# EAGLE design CONTROLADOR_MAX31865_RELE (EAGLE 7.7.0)
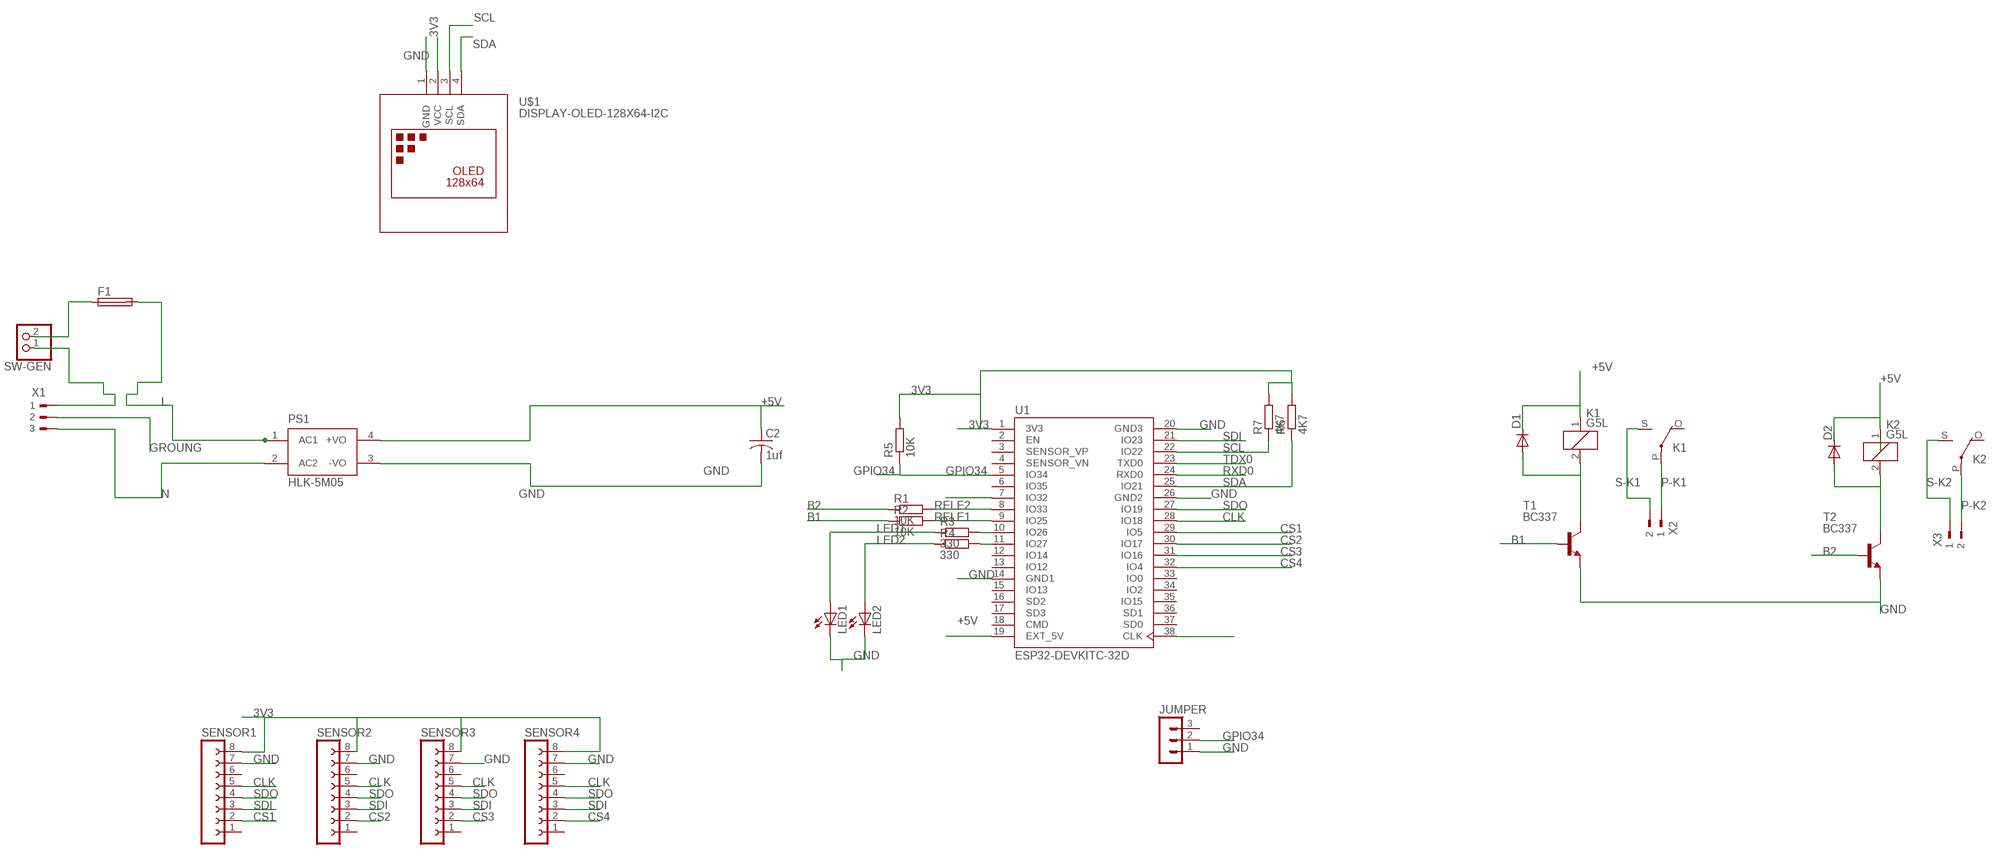
[diagram p0: schematic, sheet 1]

## Parts
C2  1uf  C-USC1206  [C1206]
D1  DIODE-DO214AC  [DO214AC]
D2  DIODE-DO214AC  [DO214AC]
F1  SH22,5A  [SH22,5A]
JUMPER  MA03-1  [MA03-1]
K1  G5L  [G5LE]
K2  G5L  [G5LE]
LED1  LED3MM  [LED3MM]
LED2  LED3MM  [LED3MM]
PS1  HLK-5M05  [CONV_HLK-5M05]
R1  10K  R-EU_M1206  [M1206]
R2  10K  R-EU_M1206  [M1206]
R3  330  R-EU_M1206  [M1206]
R4  330  R-EU_M1206  [M1206]
R5  10K  R-EU_M1206  [M1206]
R6  4K7  R-EU_M1206  [M1206]
R7  4K7  R-EU_M1206  [M1206]
SENSOR1  FE08-1  [FE08]
SENSOR2  FE08-1  [FE08]
SENSOR3  FE08-1  [FE08]
SENSOR4  FE08-1  [FE08]
SW-GEN  PINHD-1X2  [1X02]
T1  BC337  [TO92]
T2  BC337  [TO92]
U1  ESP32-DEVKITC-32D  [MODULE_ESP32-DEVKITC-32D]
U$1  DISPLAY-OLED-128X64-I2C  [DISPLAY-OLED-128X64-I2C]
X1  180G-3  [180G-3]
X2  90-2  [90-2]
X3  90-2  [90-2]

## Nets
3V3: R5.2 R6.2 R7.2 SENSOR1.8 SENSOR2.8 SENSOR3.8 SENSOR4.8 U1.1(3V3) U$1.2(VCC)
+5V: C2.1 D1.C D2.C K1.1 K2.1 PS1.4(+VO) U1.19(EXT_5V)
B1: R2.1 T1.2(B)
B2: R1.1 T2.2(B)
CCLK: U1.38(CLK)
CLK: SENSOR1.5 SENSOR2.5 SENSOR3.5 SENSOR4.5 U1.28(IO18)
CS1: SENSOR1.2 U1.29(IO5)
CS2: SENSOR2.2 U1.30(IO17)
CS3: SENSOR3.2 U1.31(IO16)
CS4: SENSOR4.2 U1.32(IO4)
GND: C2.2 JUMPER.1 LED1.K(C) LED2.K(C) PS1.3(-VO) SENSOR1.7 SENSOR2.7 SENSOR3.7 SENSOR4.7 T1.1(E) T2.1(E) U1.14(GND1) U1.20(GND3) U1.26(GND2) U$1.1(GND)
GPIO34: JUMPER.2 R5.1 U1.5(IO34)
GROUNG: X1.2
L: F1.2 PS1.1(AC1)
L.: SW-GEN.1 X1.1
LED1: LED1.A R3.1
LED2: LED2.A R4.1
N: PS1.2(AC2) X1.3
N$17: F1.1 SW-GEN.2
N$18: U1.7(IO32)
N$22: R3.2 U1.10(IO26)
N$23: R4.2 U1.11(IO27)
N$24: D1.A K1.2 T1.3(C)
N$26: D2.A K2.2 T2.3(C)
P-K1: K1.P(2:P) X2.1
P-K2: K2.P(2:P) X3.2
RELE1: R2.2 U1.9(IO25)
RELE2: R1.2 U1.8(IO33)
RXD0: U1.24(RXD0)
S-K1: K1.S(2:S) X2.2
S-K2: K2.S(2:S) X3.1
SCL: R7.1 U1.22(IO22) U$1.3(SCL)
SDA: R6.1 U1.25(IO21) U$1.4(SDA)
SDI: SENSOR1.3 SENSOR2.3 SENSOR3.3 SENSOR4.3 U1.21(IO23)
SDO: SENSOR1.4 SENSOR2.4 SENSOR3.4 SENSOR4.4 U1.27(IO19)
TDX0: U1.23(TXD0)
Unconnected: JUMPER.3 K1.O(2:O) K2.O(2:O) SENSOR1.1 SENSOR1.6 SENSOR2.1 SENSOR2.6 SENSOR3.1 SENSOR3.6 SENSOR4.1 SENSOR4.6 U1.2(EN) U1.3(SENSOR_VP) U1.4(SENSOR_VN) U1.6(IO35) U1.12(IO14) U1.13(IO12) U1.15(IO13) U1.16(SD2) U1.17(SD3) U1.18(CMD) U1.33(IO0) U1.34(IO2) U1.35(IO15) U1.36(SD1) U1.37(SD0)

## Library data of the parts
C2 = adafruit:C-US: CAPACITOR, American symbol
D1 D2 = diode:DIODE-: DIODE
F1 = fuse:SH22,5A: FUSE HOLDER grid 22,5mm, isolated cap OGN0031 8201, Schurter (Buerklin); MPN: 0031.7701.11; OC_FARNELL: unknown; OC_NEWARK: 04F1224
JUMPER = con-lstb:MA03-1: PIN HEADER; OC_FARNELL: unknown; OC_NEWARK: unknown
K1 K2 = relay:G5L: RELAY 1 x switch, 10 A/120 V AC, 8 A/30 V ADC, Omron; OC_FARNELL: unknown; OC_NEWARK: unknown
LED1 LED2 = adafruit:LED: LED OSRAM: - CHIPLED LG R971, LG N971, LY N971, LG Q971, LY Q971, LO R971, LY R971 LH N974, LH R974 LS Q976, LO Q976, LY Q976 LO Q996 - Hyper CHIPLED LW Q18S LB Q993, LB Q99A, LB R99A - SideLED LS A670, LO A670, LY A670, LG A670, LP A670 LB A673, LV A673, LT A673, LW A673 LH A674 LY A675 LS A676, LA A676, LO A676, LY A676, LW A676 LS A679, LY A679, LG A679 - Hyper Micro SIDELED® LS Y876, LA Y876, LO Y876, LY Y876 LT Y87S - SmartLED LW L88C, LW L88S LB L89C, LB L89S, LG L890 LS L89K, LO L89K, LY L89K LS L896, LA L896, LO L896, LY L896 - TOPLED LS T670, LO T670, LY T670, LG T670, LP T670 LSG T670, LSP T670, LSY T670, LOP T670, LYG T670 LG T671, LOG T671, LSG T671 LB T673, LV T673, LT T673, LW T673 LH T674 LS T676, LA T676, LO T676, LY T676, LB T676, LH T676, LSB T676, LW T676 LB T67C, LV T67C, LT T67C, LS T67K, LO T67K, LY T67K, LW E67C LS E67B, LA E67B, LO E67B, LY E67B, LB E67C, LV E67C, LT E67C LW T67C LS T679, LY T679, LG T679 LS T770, LO T770, LY T770, LG T770, LP T770 LB T773, LV T773, LT T773, LW T773 LH T774 LS E675, LA E675, LY E675, LS T675 LS T776, LA T776, LO T776, LY T776, LB T776 LHGB T686 LT T68C, LB T68C - Hyper Mini TOPLED® LB M676 - Mini TOPLED Santana® LG M470 LS M47K, LO M47K, LY M47K Source: http://www.osram.convergy.de/
PS1 = HLK-5M05:HLK-5M05: AC DC 220V to 5V 5W 5Watt Isolated Switching Step-Down Power Supply Module Converter Check availability <https://pricing.snapeda.com/parts/HLK-5M05/Hi-link/view-part?ref=eda>; AVAILABILITY: Not in stock; MF: Hi-link; MP: HLK-5M05; PACKAGE: Package; PRICE: None
R1-R7 = resistor:R-EU_: RESISTOR, European symbol
SENSOR1-SENSOR4 = con-lsta:FE08-1: FEMALE HEADER; OC_FARNELL: unknown; OC_NEWARK: unknown
SW-GEN = pinhead:PINHD-1X2: PIN HEADER
T1 T2 = transistor:BC337: NPN TRANSISTOR
U1 = ESP32-DEVKITC-32D:ESP32-DEVKITC-32D: Eval Board For Esp-Wroom-32 Check prices <https://pricing.snapeda.com/parts/ESP32-DEVKITC-32D/Espressif%20Systems/view-part?ref=eda>; AVAILABILITY: In Stock; DESCRIPTION: WiFi Development Tools (802.11) ESP32 General Development Kit, ESP32-WROOM-32D on the board; MF: Espressif Systems; MP: ESP32-DEVKITC-32D; PACKAGE: None; PRICE: None; PURCHASE-URL: https://pricing.snapeda.com/search/part/ESP32-DEVKITC-32D/?ref=eda
U$1 = cargador microusb-modules lib:DISPLAY-OLED-128X64-I2C: 128x64 Dot Matrix OLED Module based on SSD1306 chip Variant with I2C interface More details available here: http://www.instructables.com/id/Monochrome-096-i2c-OLED-display-with-arduino-SSD13/ SSD1306 datasheet: https://cdn-shop.adafruit.com/datasheets/SSD1306.pdf Click here to find device on ebay.com <http://www.ebay.com/sch/oled+display+128x64+iic> Note: There are two variants: I2C and SPI. Search for the proper version.
X1 = con-weidmueller-sl35:180G-3: WEIDMUELLER CLAMP CONNECTOR; OC_FARNELL: unknown; OC_NEWARK: unknown
X2 X3 = con-weidmueller-sl35:90-2: WEIDMUELLER CLAMP CONNECTOR; OC_FARNELL: unknown; OC_NEWARK: unknown

## Board
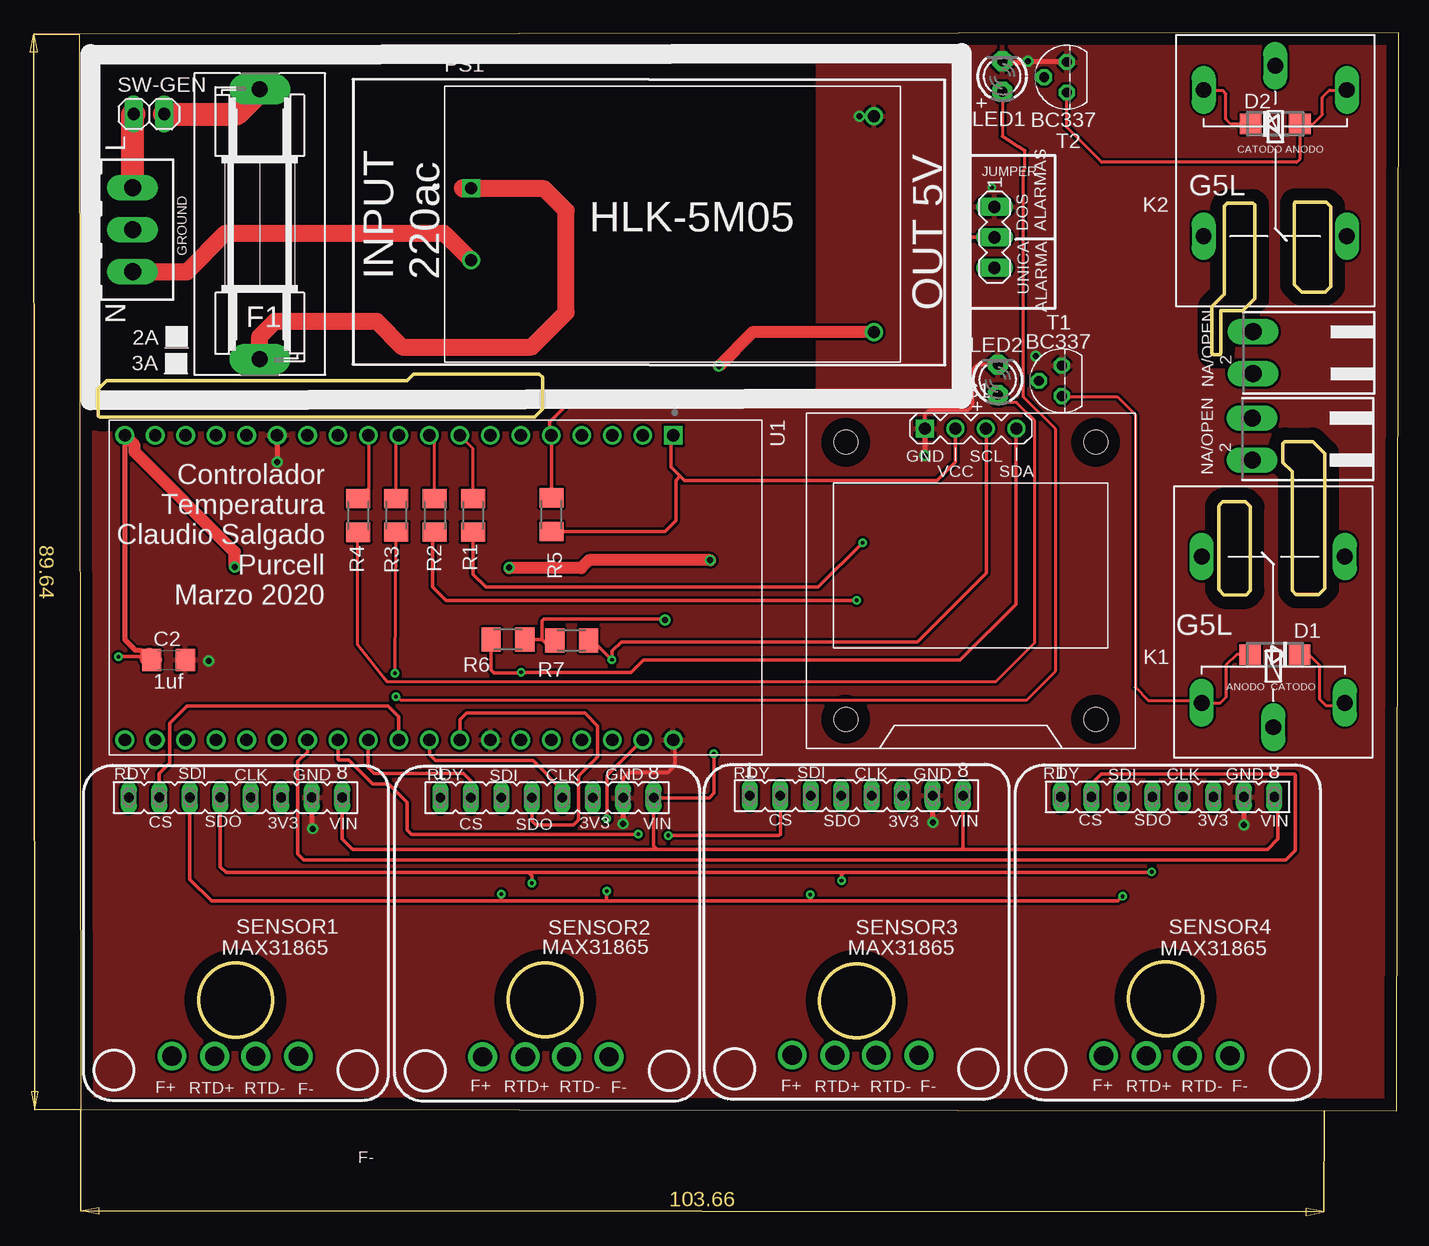
[diagram p1: board, top side]
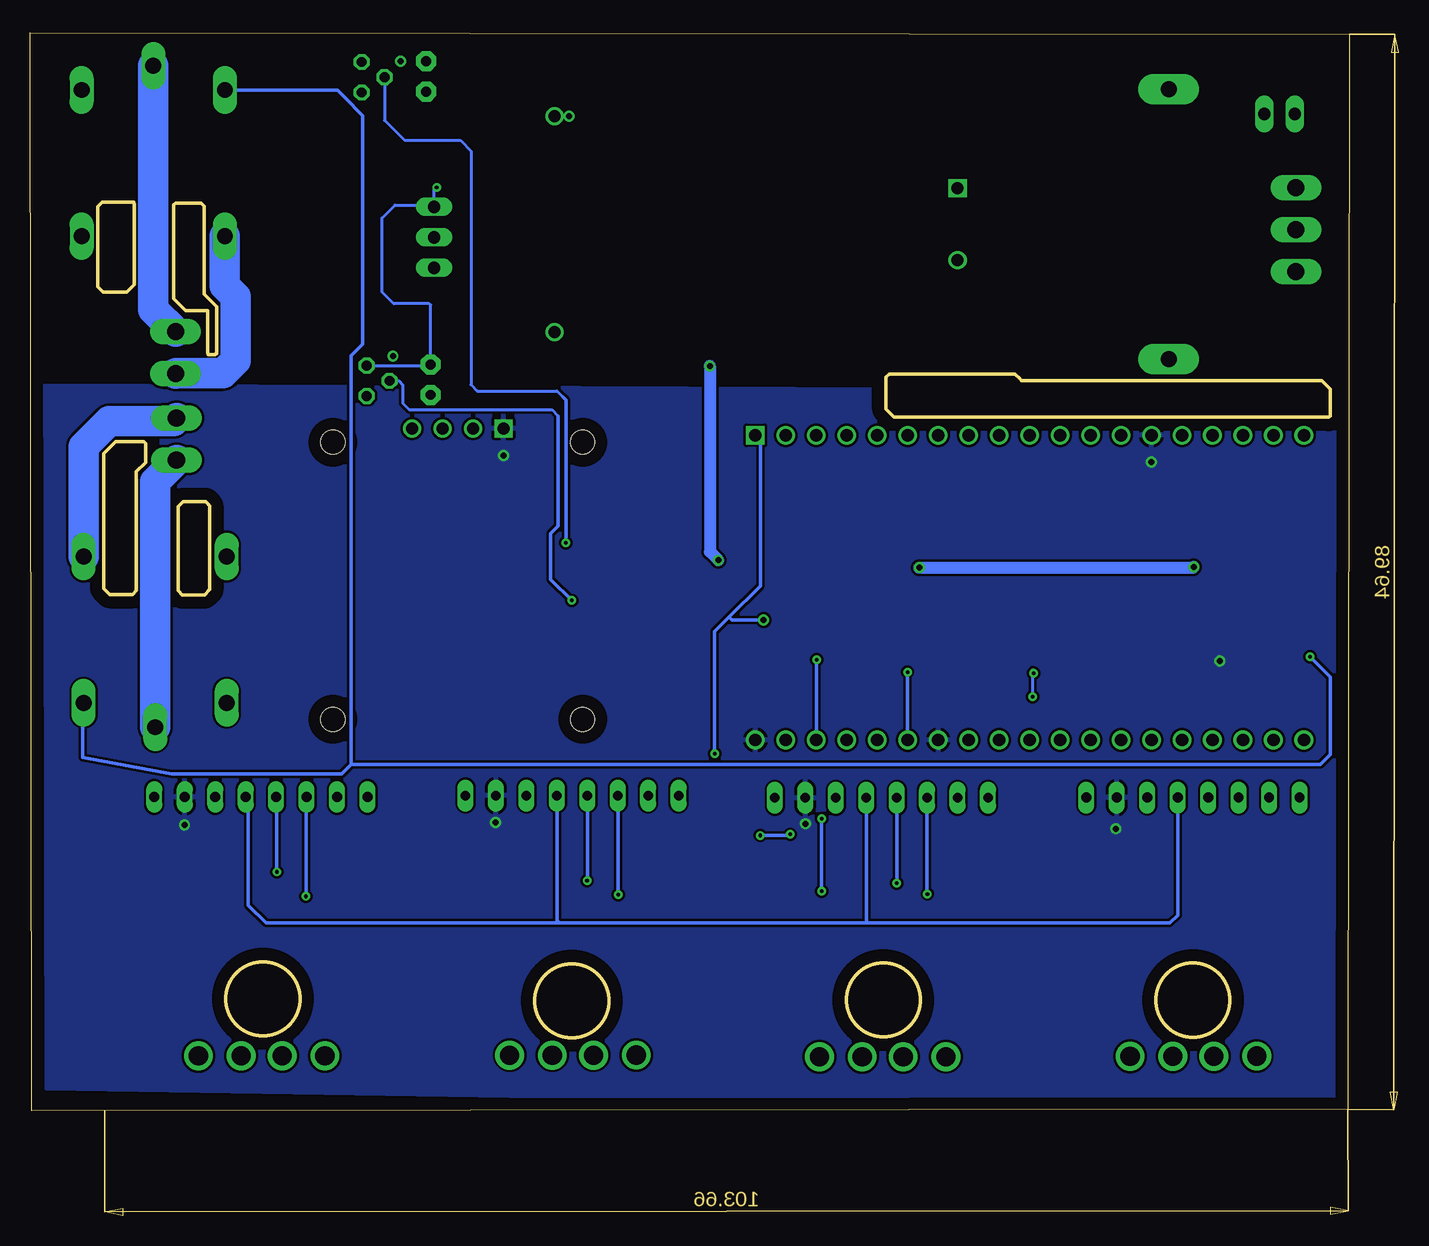
[diagram p2: board, bottom side, seen from below]

Size 109.98 x 89.86 mm. Coordinates in mm from the lower left corner, seen from the top.
Outline: 94.42,63.12 94.42,67.05 95.46,68.09 95.46,75.4 95.72,75.66
Outline: 95.76,75.69 97.84,75.69 98,75.53 98,67.7 97.01,66.71 95.16,66.7 95.16,63.27 95.12,63.05 94.54,63.05 94.44,63.15 94.45,63.15
Outline: 100.51,55.81 102.82,55.81 103.83,54.8 103.83,43.55 103.34,43.06 101.43,43.06 101.11,43.38 101.11,53.28 100.34,54.05 100.34,55.62 100.5,55.78
Outline: 101.32,75.74 103.97,75.74 104.33,75.38 104.33,68.73 103.86,68.26 101.9,68.26 101.28,68.88 101.28,75.63 101.33,75.68
Outline: 95.04,43.41 95.43,43.02 97.28,43.02 97.64,43.38 97.64,50.36 97.22,50.78 95.33,50.78 95.1,50.55 95.1,50.52 95.01,50.43 95.01,43.47 95.08,43.4
Outline: 1.72,57.84 2.24,57.84
Outline: 2.24,57.84 37.96,57.84 38.62,58.5 38.62,61.15 38.34,61.43 27.87,61.43 27.48,61.04 27.48,61.03 27.32,60.87 2.29,60.87 1.6,60.18 1.6,57.92 1.71,57.84 1.75,57.83 2.24,57.84
Outline: 0.11,0.11 109.84,0 109.98,89.86 0,89.75 0.11,0.11
Outline: circle at 13.03,9.23 radius 3.06
Outline: circle at 90.56,9.34 radius 3.06
Outline: circle at 38.84,9.24 radius 3.06
Outline: circle at 64.81,9.18 radius 3.06
Copper layers (1*16): Top 0.035mm / dielectric 1.5mm / Bottom 0.035mm
Design rules "default": minimum track width 10mil, minimum drill 24mil, track to track 8mil, track to pad 8mil, pad to pad 8mil, via to via 8mil, smd to smd 8mil, copper to edge 40mil, drill to drill 8mil, minimum pad ring 10mil, minimum via ring 8mil, stop-mask expansion 4mil, vias tented up to drill 0mil, thermal gap 10mil

### Footprints (pad centres in the part's own frame; a part is rotated, then mirrored left to right if it is on the bottom)
C1206 = smd 1.6 x 1.8: 1 -1.4,0; 2 1.4,0
DO214AC = smd 1.8 x 1.7: A 2.05,0; C -2.05,0
SH22,5A = drill 1.321 pad 2.54 long: 1 -11.252,0; 2 11.252,0
MA03-1 = drill 1.016 long: 1 -2.54,0; 2 0,0; 3 2.54,0
G5LE = drill 1.321 long: 1 -7.493,-5.969; 2 -7.493,5.969; O 4.699,5.969; P -9.525,0; S 4.699,-5.969
LED3MM = drill 0.813 pad 1.676 octagon: A -1.27,0; K 1.27,0
CONV_HLK-5M05 = drill 1 pad 1.5 square: 1 -16.8,3 | drill 1 pad 1.5: 2 -16.8,-3; 3 16.8,9; 4 16.8,-9
M1206 = smd 1.6 x 2: 1 -1.4,0; 2 1.4,0
FE08 = drill 0.813 long: 1 -8.89,0; 2 -6.35,0; 3 -3.81,0; 4 -1.27,0; 5 1.27,0; 6 3.81,0; 7 6.35,0; 8 8.89,0
1X02 = drill 1.016 long: 1 -1.27,0; 2 1.27,0
TO92 = drill 0.813 octagon: 1 1.27,0; 2 0,1.905; 3 -1.27,0
MODULE_ESP32-DEVKITC-32D = drill 1.04 square: 1 -12.7,19.76 | drill 1.04: 2 -12.7,17.22; 3 -12.7,14.68; 4 -12.7,12.14; 5 -12.7,9.6; 6 -12.7,7.06; 7 -12.7,4.52; 8 -12.7,1.98; 9 -12.7,-0.56; 10 -12.7,-3.1; 11 -12.7,-5.64; 12 -12.7,-8.18; 13 -12.7,-10.72; 14 -12.7,-13.26; 15 -12.7,-15.8; 16 -12.7,-18.34; 17 -12.7,-20.88; 18 -12.7,-23.42; 19 -12.7,-25.96; 20 12.7,19.76; 21 12.7,17.22; 22 12.7,14.68; 23 12.7,12.14; 24 12.7,9.6; 25 12.7,7.06; 26 12.7,4.52; 27 12.7,1.98; 28 12.7,-0.56; 29 12.7,-3.1; 30 12.7,-5.64; 31 12.7,-8.18; 32 12.7,-10.72; 33 12.7,-13.26; 34 12.7,-15.8; 35 12.7,-18.34; 36 12.7,-20.88; 37 12.7,-23.42; 38 12.7,-25.96
DISPLAY-OLED-128X64-I2C = drill 1 square: 1 -3.81,12.7 | drill 1: 2 -1.27,12.7; 3 1.27,12.7; 4 3.81,12.7 | hole 2: -10.414,11.557; 10.414,11.557; 10.414,-11.557; -10.414,-11.557
180G-3 = drill 1.422 long: 1 -3.5,0; 2 0,0; 3 3.5,0
90-2 = drill 1.422 long: 1 -1.75,5.25; 2 1.75,5.25

### Placement (x,y rotation side)
C2  7.45,37.59 0 top
D1  99.66,38.04 180 top
D2  99.7,82.27 0 top
F1  15.05,73.91 270 top
JUMPER  76.3,72.82 270 top
K1  99.54,41.51 90 top
K2  99.7,77.61 270 top
LED1  76.95,86.24 90 top
LED2  76.58,60.95 90 top
PS1  49.45,73.91 0 top
R1  32.82,49.65 90 top
R2  29.64,49.65 90 top
R3  26.42,49.65 90 top
R4  23.25,49.64 90 top
R5  39.37,49.7 270 top
R6  35.74,39.28 0 top
R7  41.05,39.23 180 top
SENSOR1  13.03,26.12 0 top
SENSOR2  39,26.1 0 top
SENSOR3  64.79,26.28 0 top
SENSOR4  90.73,26.17 0 top
SW-GEN  5.81,83.1 0 top
T1  81.91,60.86 90 top
T2  82.33,86.17 90 top
U1  29.75,43.62 270 top
U$1  74.32,44.19 0 top
X1  4.45,73.46 270 top
X2  103.02,56 90 top
X3  103.1,63.2 90 top

### Tracks (layer width: path | path; a pad name or v marks a point on that pad's centre or on a via)
3V3  (via drill 0.3, 0.5)
  Top 0.305: 50.09,52.91 50.46,52.54 71.49,52.54 73.05,54.1 U$1.2 | 50.09,52.91 49.32,53.68 49.32,56.13 U1.1 | 50.09,52.91 49.73,52.54 49.73,49.21 48.82,48.3 R5.2 | SENSOR1.8 21.92,22.67 22.79,21.8 48.18,21.8 | 48.18,21.8 73.64,21.8 | 73.64,21.8 99.06,21.8 99.93,22.67 99.93,25.86 SENSOR4.8 | SENSOR3.8 73.68,21.84 73.64,21.8 | 48.18,21.8 47.89,22.09 SENSOR2.8 52.53,26.1 52.92,26.49 52.92,29.74 v52.9,29.76 | R6.2 38.6,39.28 | 38.6,39.28 39.09,38.79 39.21,38.79 R7.2 | 38.6,39.28 38.6,40.83 38.76,40.99 48.75,40.99 v48.82,40.92
  Bottom 0.305: v52.9,29.76 52.9,39.96 51.69,41.17 | 51.69,41.17 49.09,43.77 49.09,55.9 U1.1 | v48.82,40.92 51.44,40.92 51.69,41.17
+5V  (via drill 0.3, 0.5)
  Top 0.254: D2.C 96,82.27 95.6,82.67 95.6,84.76 95.31,85.05 93.78,85.05 K2.1 | D1.C 102.49,38.04 103.38,37.15 103.38,34.34 103.93,33.79 105.28,33.79 K1.1
  Top 0.305: v3.28,37.86 5.64,37.86 5.78,37.86 C2.1
  Top 0.406: U1.19 3.79,39.29 4.68,38.4 5.1,38.4 5.64,37.86
  Top 1.016: PS1.4 56.12,64.91 v53.31,62.1 | v52.6,45.9 42.48,45.9 41.83,45.25 35.87,45.25 v35.84,45.28 | v12.96,45.34 12.96,46.6 4.61,54.95 4.61,55.5 U1.19
  Top 1.676: 5.85,37.79 C2.1
  Bottom 0.305: K2.1 84.35,85.1 83.77,84.52 83.77,84.49 82.24,82.96 82.24,63.94 83.22,62.96 83.22,28.88 | 83.22,28.88 84.01,28.09 98.18,28.09 105.59,29.45 105.59,33.22 105.02,33.79 105.28,33.79 K1.1 | 83.22,28.88 2.41,28.88 1.57,29.72 1.57,36.15 v3.28,37.86
  Bottom 1.016: v53.31,62.1 53.31,46.61 v52.6,45.9 | v35.84,45.28 13.02,45.28 v12.96,45.34
B1  (via drill 0.3)
  Top 0.254: 29.47,48.08 R2.1
  Top 0.305: v64.81,42.55 30.57,42.55 29.45,43.67 29.45,48.06 R2.1
  Bottom 0.254: T1.2 79.22,60.86 78.9,60.54 78.9,58.99 78.36,58.45 66.48,58.45 65.94,57.91
  Bottom 0.305: 65.94,57.91 65.94,48.77 66.57,48.14 66.57,44.31 v64.81,42.55
B2  (via drill 0.3)
  Top 0.254: R1.1
  Top 0.305: R1.1 32.83,44.73 33.9,43.66 61.6,43.66 v65.31,47.37
  Bottom 0.254: T2.2 80.42,82.58 78.75,80.9 74.09,80.9 73.21,80.02 73.21,60.54 72.69,60.02 66.06,60.02 65.52,59.48 65.44,59.4
  Bottom 0.305: v65.31,47.37 65.31,59.27 65.52,59.48
CLK
  Top 0.305: U1.28 29.19,29.72 29.7,29.21 37.81,29.21 40.1,26.92 40.1,26.27 SENSOR2.5
  Bottom 0.305: SENSOR1.5 14.3,16.3 14.95,15.65 40.38,15.65 | 40.38,15.65 65.85,15.65 | 65.85,15.65 90.29,15.65 91.78,17.14 91.78,25.95 SENSOR4.5 | SENSOR3.5 66.06,15.86 65.85,15.65 | SENSOR2.5 40.27,15.76 40.38,15.65
CS1
  Top 0.305: SENSOR1.2 6.68,28.14 7.54,29 7.54,32.29 8.99,33.74 25.74,33.74 26.62,32.86 26.62,30.95 U1.29
CS2
  Top 0.305: SENSOR2.2 32.65,27.5 32.02,28.13 24.56,28.13 24.07,28.62 24.07,30.88 U1.30
CS3  (via drill 0.3)
  Top 0.305: SENSOR3.2 58.44,23.05 58.35,22.96 v49.1,22.96 | v46.61,23.05 27.72,23.05 27.34,23.43 27.34,25.72 25.8,27.26 24.44,27.26 22.46,29.24 21.61,29.24 21.56,29.29 U1.31
  Bottom 0.305: v49.1,22.96 46.7,22.96 v46.61,23.05
CS4
  Top 0.305: U1.32 19.03,29.93 18.21,29.11 18.21,21.41 18.69,20.93 100.58,20.93 101.36,21.71 101.36,28.01 101.27,28.1 85.21,28.1 84.36,27.25 84.36,26.19 SENSOR4.2
GND  (via drill 0.3, 0.5)
  Top 0.305: LED2.K 74.89,62.22 74.46,61.79 74.46,58.8 74.07,58.41 70.87,58.41 70.51,58.05 U$1.1 | SENSOR2.7 45.35,27.72 45.83,28.2 49.09,28.2 49.67,28.78 49.67,30.76 U1.20 49.89,30.54 | 71.22,26.36 SENSOR3.7
  Top 0.406: PS1.3 v65.05,82.91 | U1.14 16.49,54.12 v16.51,54.1 | SENSOR1.7 19.38,23.59 v19.45,23.52 | SENSOR2.7 v45.35,23.95 v45.34,23.94 | SENSOR3.7 71.14,24.07 v71.16,24.05 | SENSOR4.7 97.08,23.86 v97.1,23.84 | 77.02,87.44 79.03,87.44 v79.09,87.5 82.27,87.5 T2.1 | U$1.1 v70.51,54.62
  Bottom 0.254: T1.1 76.67,62.13 LED2.K 76.58,67.17 76.69,67.28 79.65,67.28 80.63,68.26 80.63,74.44 79.55,75.52 76.46,75.52 JUMPER.1 76.3,76.77 v76.08,76.99
  other vias: 10.78,37.5 79.73,62.93
  pour Bottom: 1.21,59.93 108.96,60.43 108.66,1.94 -2.16,0.12 -1.96,59.9
  pour Top: -1.98,0.05 108.92,0.05 108.92,60.19 -2.03,60.19 -2.03,0.01
  pour Top: 61.67,89.57 108.83,89.57 108.83,59.53 61.63,59.53 61.63,89.5
GPIO34
  Top 0.305: R5.1 39.37,56.3 U1.5 39.19,56.48 39.19,57.43 41.11,59.35 72.74,59.35 73.53,60.14 73.53,71.95 74.4,72.82 JUMPER.2
L
  Top 1.422: F1.2 15.05,64.55 16.32,65.82 24.8,65.82 26.93,63.69 37.72,63.69 40.59,66.56 40.59,75.04 38.76,76.87 31.99,76.87 31.93,76.93 32.63,76.93 PS1.1
L.
  Top 1.93: X1.1 4.45,83.01 SW-GEN.1
LED1  (via drill 0.3)
  Top 0.254: LED1.A 76.95,81.25 78.84,80.06 78.83,80.05 78.83,78.57 78.71,78.45 78.71,59.51 81.4,56.82 81.4,36.69 78.94,34.23 26.87,34.23 v26.39,34.53 | v26.31,36.49 26.4,48.23 R3.1
  Bottom 0.254: v26.39,34.53 26.39,36.77 v26.31,36.49
LED2
  Top 0.254: R4.1 23.21,48.2 23.21,38.84 25.65,35.76 76.38,35.76 79.66,39.04 79.66,57.53 78.14,59.05 77.21,59.05 LED2.A
N
  Top 1.422: X1.3 8.99,69.96 12.18,73.15 30.41,73.15 PS1.2
N$1  (via drill 1.6)
  other vias: 7.72,4.56
N$2  (via drill 1.6)
  other vias: 11.28,4.55
N$3  (via drill 1.6)
  other vias: 14.71,4.55
N$4  (via drill 1.6)
  other vias: 18.27,4.55
N$5  (via drill 1.6)
  other vias: 59.44,4.65
N$6  (via drill 1.6)
  other vias: 63,4.64
N$7  (via drill 1.6)
  other vias: 66.43,4.64
N$8  (via drill 1.6)
  other vias: 69.99,4.64
N$9  (via drill 1.6)
  other vias: 85.39,4.59
N$10  (via drill 1.6)
  other vias: 88.95,4.58
N$11  (via drill 1.6)
  other vias: 92.38,4.58
N$12  (via drill 1.6)
  other vias: 95.94,4.58
N$13  (via drill 1.6)
  other vias: 33.62,4.51
N$14  (via drill 1.6)
  other vias: 37.18,4.5
N$15  (via drill 1.6)
  other vias: 40.61,4.5
N$16  (via drill 1.6)
  other vias: 44.17,4.5
N$17
  Top 1.93: SW-GEN.2 13.12,83.1 14.73,84.71 14.73,84.84 F1.1
N$22
  Top 0.254: R3.2 26.42,56.09 U1.10
N$23
  Top 0.254: U1.11 24.11,51.9 R4.2
N$24
  Top 0.254: D1.A 96.49,38.04 95.6,37.15 95.6,34.48 95.1,33.98 93.61,33.98 K1.2 93.36,34.23 89.11,34.23 88.02,35.32 88.02,58.03 86.52,59.53 81.97,59.53 T1.3
N$26
  Top 0.254: K2.2 105.66,85.09 104.22,85.09 103.63,84.5 103.63,83.06 102.84,82.27 D2.A 101.75,79.35 101.47,79.07 85.24,79.07 82.31,82 82.31,84.88 T2.3
P-K1
  Bottom 2.54: K1.P 99.54,52.48 X2.1
P-K2
  Bottom 2.54: K2.P 99.7,66.8 X3.2
RELE1
  Top 0.254: R2.2 29.64,55.87 U1.9
RELE2
  Top 0.254: R1.2 32.82,55.23 U1.8
S-K1
  Bottom 2.54: K1.S 105.51,55.39 103.38,57.52 98,57.52 X2.2
S-K2
  Bottom 2.54: K2.S 93.73,68.78 92.83,67.88 92.83,62.56 93.88,61.51 97.79,61.51 X3.1
SCL  (via drill 0.3)
  Top 0.305: R7.1 42.78,39.23 v44.41,37.6 44.41,38.32 45.19,39.1 69.86,39.1 75.61,44.85 75.61,56.87 U$1.3
  Bottom 0.305: v44.41,37.6 44.41,30.94 U1.22
SDA  (via drill 0.3)
  Top 0.305: R6.1 34.34,36.74 34.59,36.49 36.74,36.49 v36.83,36.58 36.85,36.56 46.01,36.56 47.05,37.6 73.43,37.6 78.06,42.23 78.06,56.82 U$1.4
  Bottom 0.305: v36.83,36.58 36.83,30.94 U1.25
SDI  (via drill 0.3)
  Top 0.305: SENSOR1.3 9.22,19.31 11.04,17.49 35.31,17.49 | 35.31,17.49 43.83,17.49 | 43.83,17.49 61.12,17.49 | 61.12,17.49 86.58,17.49 v86.97,17.88 | v35.17,18.08 35.17,17.63 35.31,17.49 | v60.94,18.03 60.94,17.67 61.12,17.49 | U1.21 46.95,30.92 43.99,27.96 v43.99,24.37 | v43.97,18.31 43.97,17.63 43.83,17.49
  Bottom 0.305: v86.97,17.88 86.97,26.12 SENSOR4.3 | SENSOR2.3 35.19,18.1 v35.17,18.08 | SENSOR3.3 60.98,18.07 v60.94,18.03 | v43.99,24.37 43.99,18.33 v43.97,18.31
SDO  (via drill 0.3)
  Top 0.305: SENSOR1.4 11.76,20.35 12.23,19.88 37.44,19.88 | 37.44,19.88 63.76,19.88 | 63.76,19.88 89.37,19.88 v89.41,19.92 | v37.74,18.98 37.74,19.58 37.44,19.88 | v63.54,19.19 63.54,19.66 63.76,19.88 | U1.27 31.73,32.61 32.28,33.16 42.16,33.16 43.22,32.1 43.22,29.5 41.64,27.92 41.64,24.25 41.22,23.83 38.06,23.83 37.73,24.16 SENSOR2.4
  Bottom 0.305: v89.41,19.92 89.41,26.12 SENSOR4.4 | SENSOR2.4 v37.73,18.99 v37.74,18.98 | SENSOR3.4 63.52,19.21 v63.54,19.19

### Text on the board
tPlace: F+ | RTD+ | RTD- | F- | F+ | RTD+ | RTD- | F- | F+ | RTD+ | RTD- | F- | F+ | RTD+ | RTD- | F- | F-
tNames: L | CATODO ANODO | HLK-5M05 | UNICA / ALARMA | DOS / ALARMAS | GROUND | INPUT / 220ac | OUT 5V | N | 2A __ | 3A __ | NA/OPEN / 2 | Controlador / Temperatura / Claudio Salgado / Purcell / Marzo 2020 | NA/OPEN / 2 | ANODO CATODO | RDY | SDI | CLK | GND | RDY | SDI | CLK | GND | RDY | SDI | CLK | GND | RDY | SDI | CLK | GND | CS | SDO | 3V3 | VIN | CS | SDO | 3V3 | VIN | CS | SDO | 3V3 | VIN | CS | SDO | 3V3 | VIN | MAX31865 | MAX31865 | MAX31865 | MAX31865